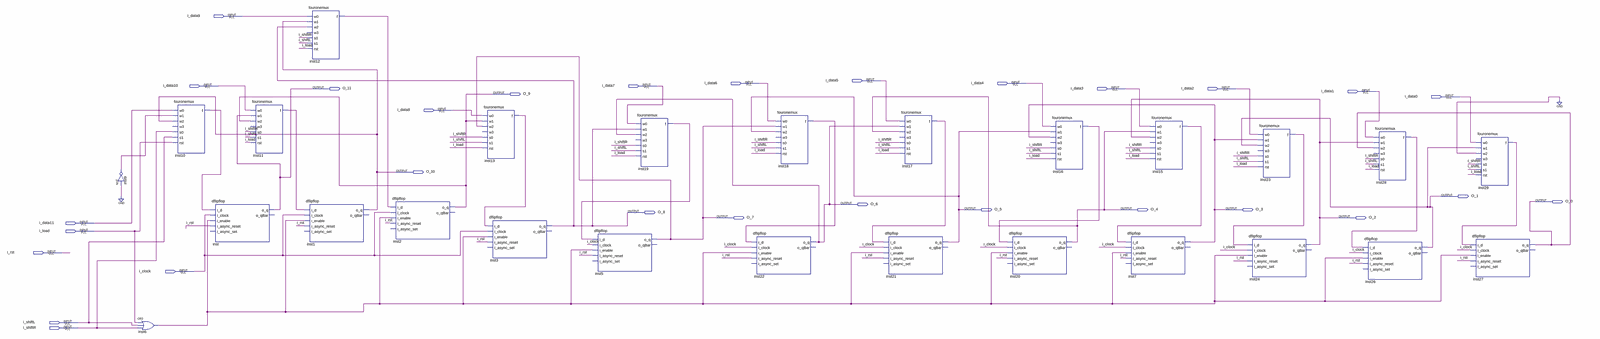
[diagram p0: schematic sheet, whole]
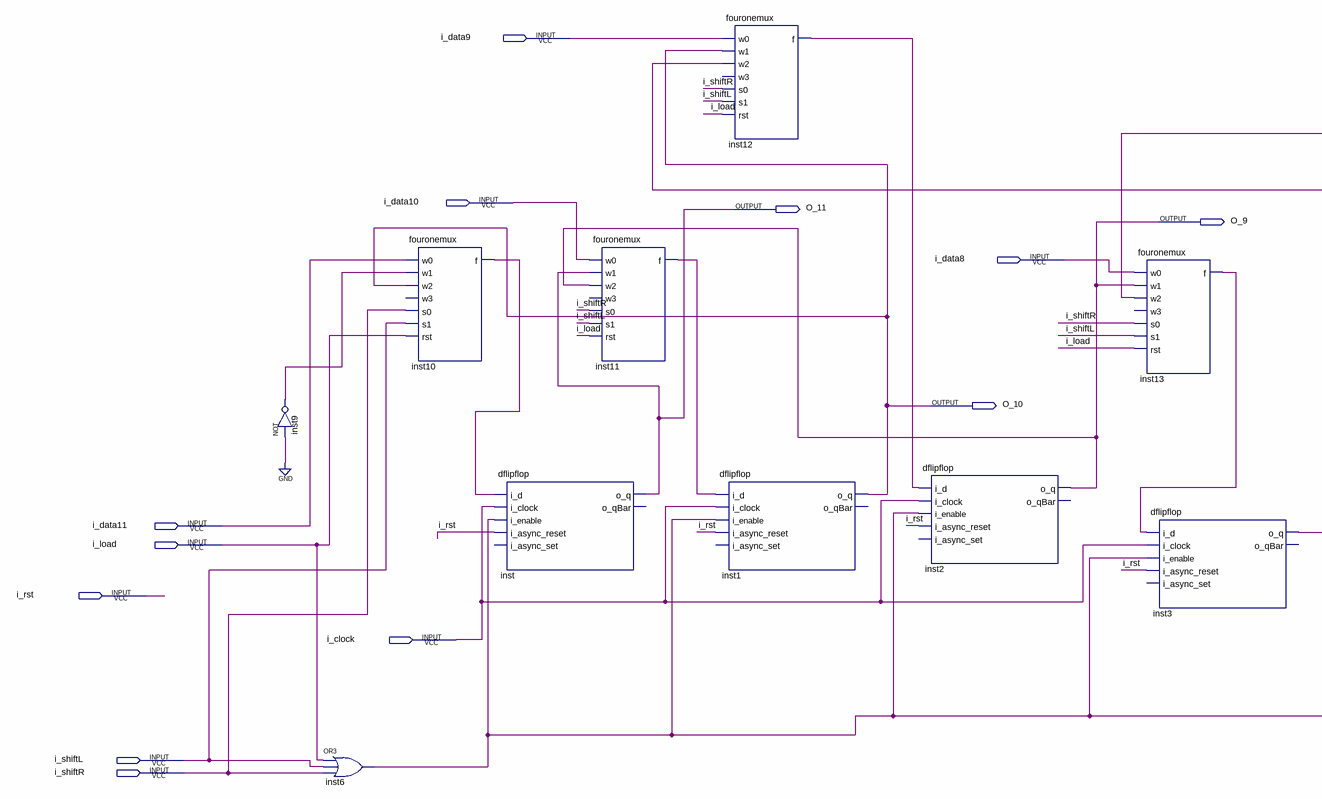
[diagram p1: schematic sheet, left part]
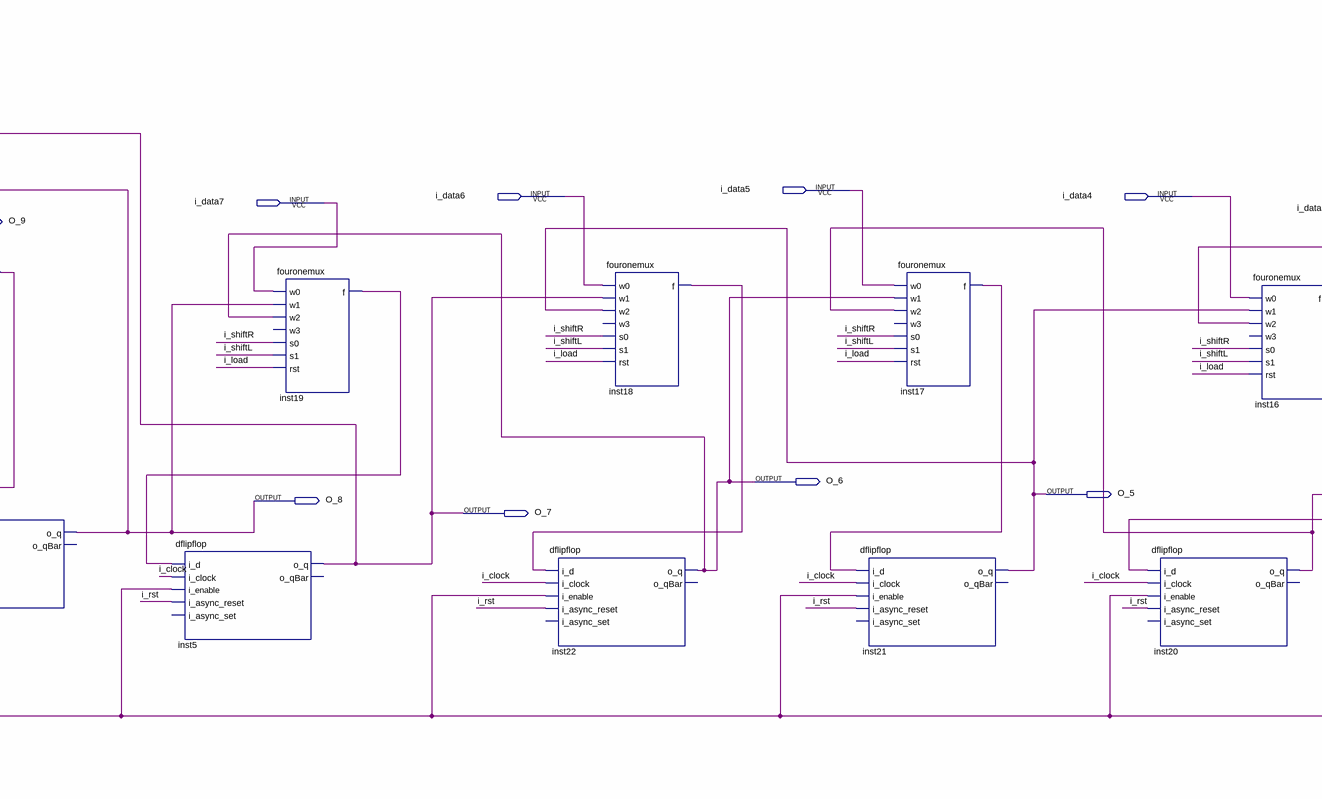
[diagram p2: schematic sheet, centre part]
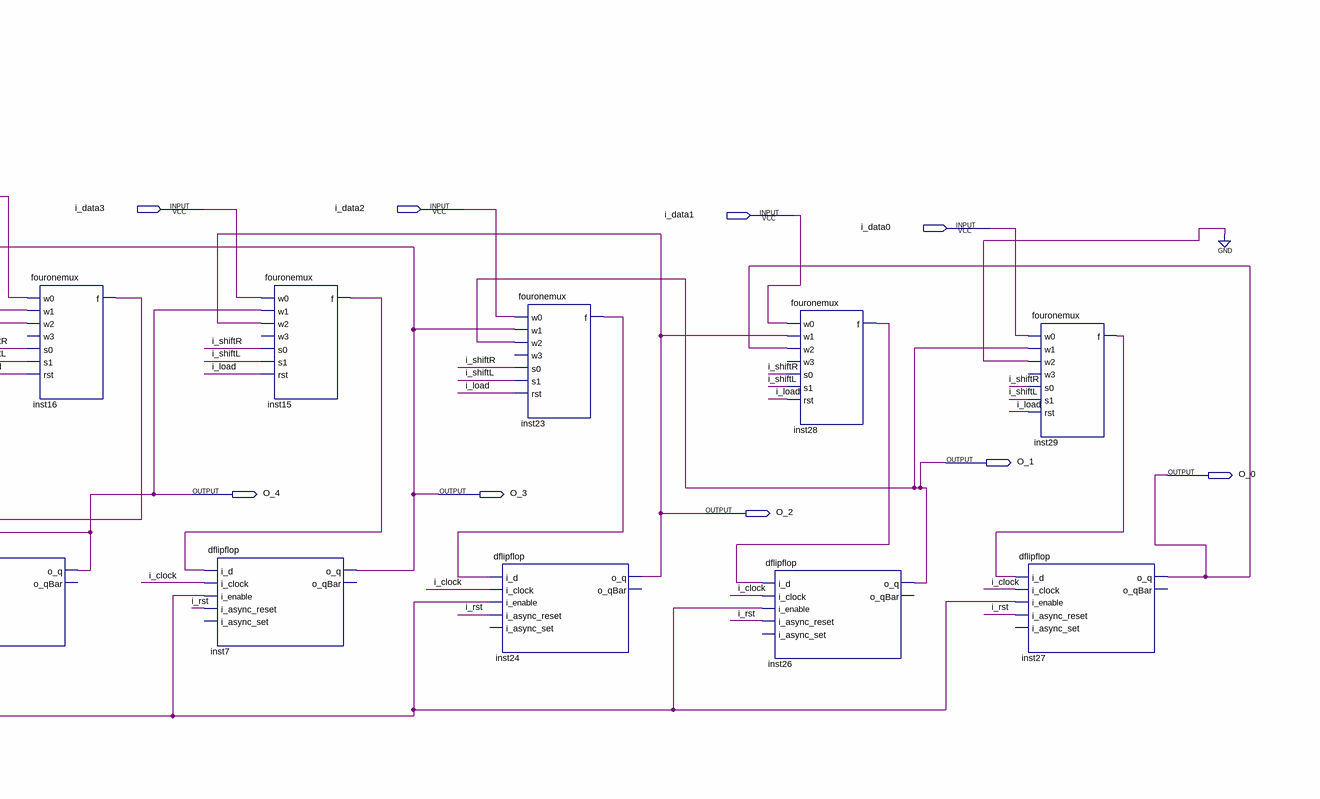
[diagram p3: schematic sheet, right part]
// Quartus schematic bi_shift_12bit_filledWith1.bdf as structural Verilog: 26 symbols, 29 pins
module bi_shift_12bit_filledWith1 (
  input  i_data9,
  input  i_data5,
  input  i_data6,
  input  i_data4,
  input  i_data10,
  input  i_data7,
  input  i_data3,
  input  i_data2,
  input  i_data1,
  input  i_data0,
  input  i_data8,
  input  i_data11,
  input  i_load,
  input  i_rst,
  input  i_clock,
  input  i_shiftL,
  input  i_shiftR,
  output O_11,
  output O_9,
  output O_10,
  output O_1,
  output O_0,
  output O_6,
  output O_5,
  output O_4,
  output O_3,
  output O_8,
  output O_7,
  output O_2
);

  wire inst6_out, inst9_out, inst10_f, inst11_f, inst12_f, inst13_f, inst15_f, inst16_f, inst17_f, inst18_f,
       inst19_f, inst23_f, inst28_f, inst29_f;

  not inst9 (inst9_out, 1'b0);
  or inst6 (inst6_out, i_load, i_shiftL, i_shiftR);
  fouronemux inst10 (
    .w0(i_data11), .w1(inst9_out), .w2(O_10), .s0(i_shiftR), .s1(i_shiftL), .rst(i_load), .f(inst10_f));  // open: w3
  dflipflop inst (
    .i_d(inst10_f), .i_clock(i_clock), .i_enable(inst6_out), .i_async_reset(i_rst), .o_q(O_11));  // open: i_async_set, o_qBar
  fouronemux inst11 (
    .w0(i_data10), .w1(O_11), .w2(O_9), .s0(i_shiftR), .s1(i_shiftL), .rst(i_load), .f(inst11_f));  // open: w3
  fouronemux inst12 (
    .w0(i_data9), .w1(O_10), .w2(O_8), .s0(i_shiftR), .s1(i_shiftL), .rst(i_load), .f(inst12_f));  // open: w3
  dflipflop inst1 (
    .i_d(inst11_f), .i_clock(i_clock), .i_enable(inst6_out), .i_async_reset(i_rst), .o_q(O_10));  // open: i_async_set, o_qBar
  dflipflop inst2 (
    .i_d(inst12_f), .i_clock(i_clock), .i_enable(inst6_out), .i_async_reset(i_rst), .o_q(O_9));  // open: i_async_set, o_qBar
  fouronemux inst13 (
    .w0(i_data8), .w1(O_9), .w2(O_7), .s0(i_shiftR), .s1(i_shiftL), .rst(i_load), .f(inst13_f));  // open: w3
  dflipflop inst3 (
    .i_d(inst13_f), .i_clock(i_clock), .i_enable(inst6_out), .i_async_reset(i_rst), .o_q(O_8));  // open: i_async_set, o_qBar
  dflipflop inst5 (
    .i_d(inst19_f), .i_clock(i_clock), .i_enable(inst6_out), .i_async_reset(i_rst), .o_q(O_7));  // open: i_async_set, o_qBar
  fouronemux inst19 (
    .w0(i_data7), .w1(O_8), .w2(O_6), .s0(i_shiftR), .s1(i_shiftL), .rst(i_load), .f(inst19_f));  // open: w3
  dflipflop inst22 (
    .i_d(inst18_f), .i_clock(i_clock), .i_enable(inst6_out), .i_async_reset(i_rst), .o_q(O_6));  // open: i_async_set, o_qBar
  fouronemux inst18 (
    .w0(i_data6), .w1(O_7), .w2(O_5), .s0(i_shiftR), .s1(i_shiftL), .rst(i_load), .f(inst18_f));  // open: w3
  dflipflop inst21 (
    .i_d(inst17_f), .i_clock(i_clock), .i_enable(inst6_out), .i_async_reset(i_rst), .o_q(O_5));  // open: i_async_set, o_qBar
  fouronemux inst17 (
    .w0(i_data5), .w1(O_6), .w2(O_4), .s0(i_shiftR), .s1(i_shiftL), .rst(i_load), .f(inst17_f));  // open: w3
  dflipflop inst20 (
    .i_d(inst16_f), .i_clock(i_clock), .i_enable(inst6_out), .i_async_reset(i_rst), .o_q(O_4));  // open: i_async_set, o_qBar
  fouronemux inst16 (
    .w0(i_data4), .w1(O_5), .w2(O_3), .s0(i_shiftR), .s1(i_shiftL), .rst(i_load), .f(inst16_f));  // open: w3
  dflipflop inst7 (
    .i_d(inst15_f), .i_clock(i_clock), .i_enable(inst6_out), .i_async_reset(i_rst), .o_q(O_3));  // open: i_async_set, o_qBar
  fouronemux inst15 (
    .w0(i_data3), .w1(O_4), .w2(O_2), .s0(i_shiftR), .s1(i_shiftL), .rst(i_load), .f(inst15_f));  // open: w3
  dflipflop inst24 (
    .i_d(inst23_f), .i_clock(i_clock), .i_enable(inst6_out), .i_async_reset(i_rst), .o_q(O_2));  // open: i_async_set, o_qBar
  fouronemux inst23 (
    .w0(i_data2), .w1(O_3), .w2(O_1), .s0(i_shiftR), .s1(i_shiftL), .rst(i_load), .f(inst23_f));  // open: w3
  dflipflop inst26 (
    .i_d(inst28_f), .i_clock(i_clock), .i_enable(inst6_out), .i_async_reset(i_rst), .o_q(O_1));  // open: i_async_set, o_qBar
  fouronemux inst28 (
    .w0(i_data1), .w1(O_2), .w2(O_0), .s0(i_shiftR), .s1(i_shiftL), .rst(i_load), .f(inst28_f));  // open: w3
  dflipflop inst27 (
    .i_d(inst29_f), .i_clock(i_clock), .i_enable(inst6_out), .i_async_reset(i_rst), .o_q(O_0));  // open: i_async_set, o_qBar
  fouronemux inst29 (
    .w0(i_data0), .w1(O_1), .w2(1'b0), .s0(i_shiftR), .s1(i_shiftL), .rst(i_load), .f(inst29_f));  // open: w3
endmodule
